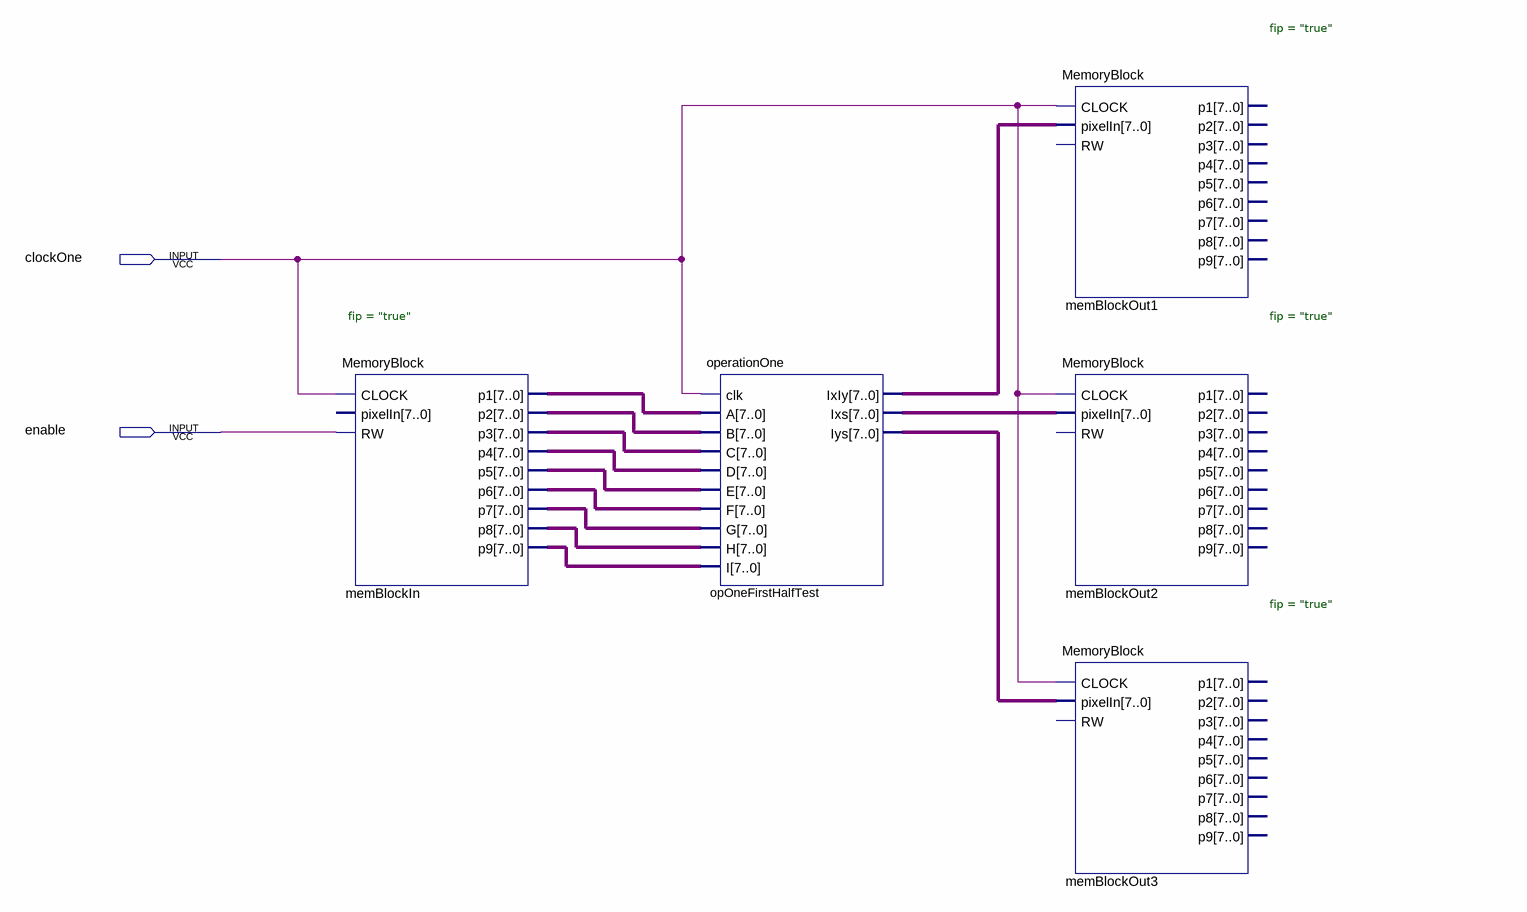
[diagram p0: schematic sheet]
// Quartus schematic firstHalf.bdf as structural Verilog: 5 symbols, 2 pins
module firstHalf (
  input  clockOne,
  input  enable
);

  wire [7:0] memBlockIn_p1, memBlockIn_p2, memBlockIn_p3, memBlockIn_p4, memBlockIn_p5, memBlockIn_p6,
       memBlockIn_p7, memBlockIn_p8, memBlockIn_p9, opOneFirstHalfTest_ixiy, opOneFirstHalfTest_ixs,
       opOneFirstHalfTest_iys;

  MemoryBlock #(.fip("true")) memBlockIn (
    .CLOCK(clockOne), .RW(enable), .p1(memBlockIn_p1), .p2(memBlockIn_p2), .p3(memBlockIn_p3),
    .p4(memBlockIn_p4), .p5(memBlockIn_p5), .p6(memBlockIn_p6), .p7(memBlockIn_p7), .p8(memBlockIn_p8),
    .p9(memBlockIn_p9));  // open: pixelIn
  operationOne opOneFirstHalfTest (
    .clk(clockOne), .A(memBlockIn_p1), .B(memBlockIn_p2), .C(memBlockIn_p3), .D(memBlockIn_p4),
    .E(memBlockIn_p5), .F(memBlockIn_p6), .G(memBlockIn_p7), .H(memBlockIn_p8), .I(memBlockIn_p9),
    .IxIy(opOneFirstHalfTest_ixiy), .Ixs(opOneFirstHalfTest_ixs), .Iys(opOneFirstHalfTest_iys));
  MemoryBlock #(.fip("true")) memBlockOut1 (
    .CLOCK(clockOne), .pixelIn(opOneFirstHalfTest_ixiy));  // open: RW, p1, p2, p3, p4, p5, p6, p7, p8, p9
  MemoryBlock #(.fip("true")) memBlockOut2 (
    .CLOCK(clockOne), .pixelIn(opOneFirstHalfTest_ixs));  // open: RW, p1, p2, p3, p4, p5, p6, p7, p8, p9
  MemoryBlock #(.fip("true")) memBlockOut3 (
    .CLOCK(clockOne), .pixelIn(opOneFirstHalfTest_iys));  // open: RW, p1, p2, p3, p4, p5, p6, p7, p8, p9
endmodule
